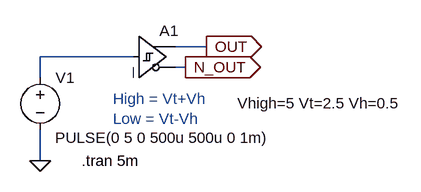
[diagram p0: schematic DigitalTest2.asc]
DigitalTest2.asc, the LTspice schematic file:
Version 4
SHEET 1 880 680
WIRE 288 112 240 112
WIRE 176 128 32 128
WIRE 256 144 240 144
WIRE 32 160 32 128
WIRE 32 288 32 240
FLAG 288 112 OUT
IOPIN 288 112 Out
FLAG 32 288 0
FLAG 256 144 N_OUT
IOPIN 256 144 Out
SYMBOL voltage 32 144 R0
WINDOW 123 0 0 Left 0
WINDOW 39 0 0 Left 0
WINDOW 3 23 108 Left 2
SYMATTR Value PULSE(0 5 0 500u 500u 0 1m)
SYMATTR InstName V1
SYMBOL Digital\\schmitt 176 64 R0
WINDOW 39 160 135 Left 2
SYMATTR InstName A1
SYMATTR SpiceLine Vhigh=5 Vt=2.5 Vh=0.5
TEXT 96 288 Left 2 !.tran 5m
TEXT 144 192 Left 2 ;High = Vt+Vh\nLow = Vt-Vh

The netlist it stands for:
* DigitalTest2.asc
V1 N001 0 PULSE(0 5 0 500u 500u 0 1m)
A1 N001 0 0 0 0 N_OUT OUT 0 SCHMITT Vhigh=5 Vt=2.5 Vh=0.5
.tran 5m
* High = Vt+Vh
* Low = Vt-Vh
.backanno
.end